# EAGLE schematic ds3231 (EAGLE 8.3.0)
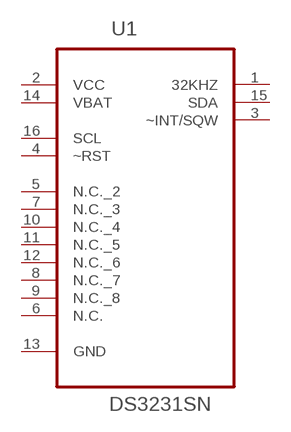
[diagram p0: schematic, sheet 1]

## Parts
U1  DS3231SN  [SOIC127P1032X265-16N]
Unconnected: U1.1(32KHZ) U1.3(~INT/SQW) U1.4(~RST) U1.5(N.C._2) U1.6(N.C.) U1.7(N.C._3) U1.8(N.C._7) U1.9(N.C._8) U1.10(N.C._4) U1.11(N.C._5) U1.12(N.C._6) U1.13(GND) U1.15(SDA) U1.16(SCL)

## Power pins joined to a net without a drawn wire
VBAT: U1.14(VBAT)
VCC: U1.2(VCC)

## Library data of the parts
U1 = Maxim_By_element14_Batch_1:DS3231SN: Extremely Accurate I2C-Integrated RTC/TCXO/Crystal; MPN: DS3231SN#; OC_FARNELL: 1593292; OC_NEWARK: 68K3406; PACKAGE: SOIC-16; SUPPLIER: Maxim